# EasyEDA schematic Schematic_ESP8266_SensorBoard_With_Battery_protection.json
TITLE: Sheet_1; REV: 1.0; Date: 2022-03-02; Sheet: 1/1; Drawn By: drkoster; Company: Your Company
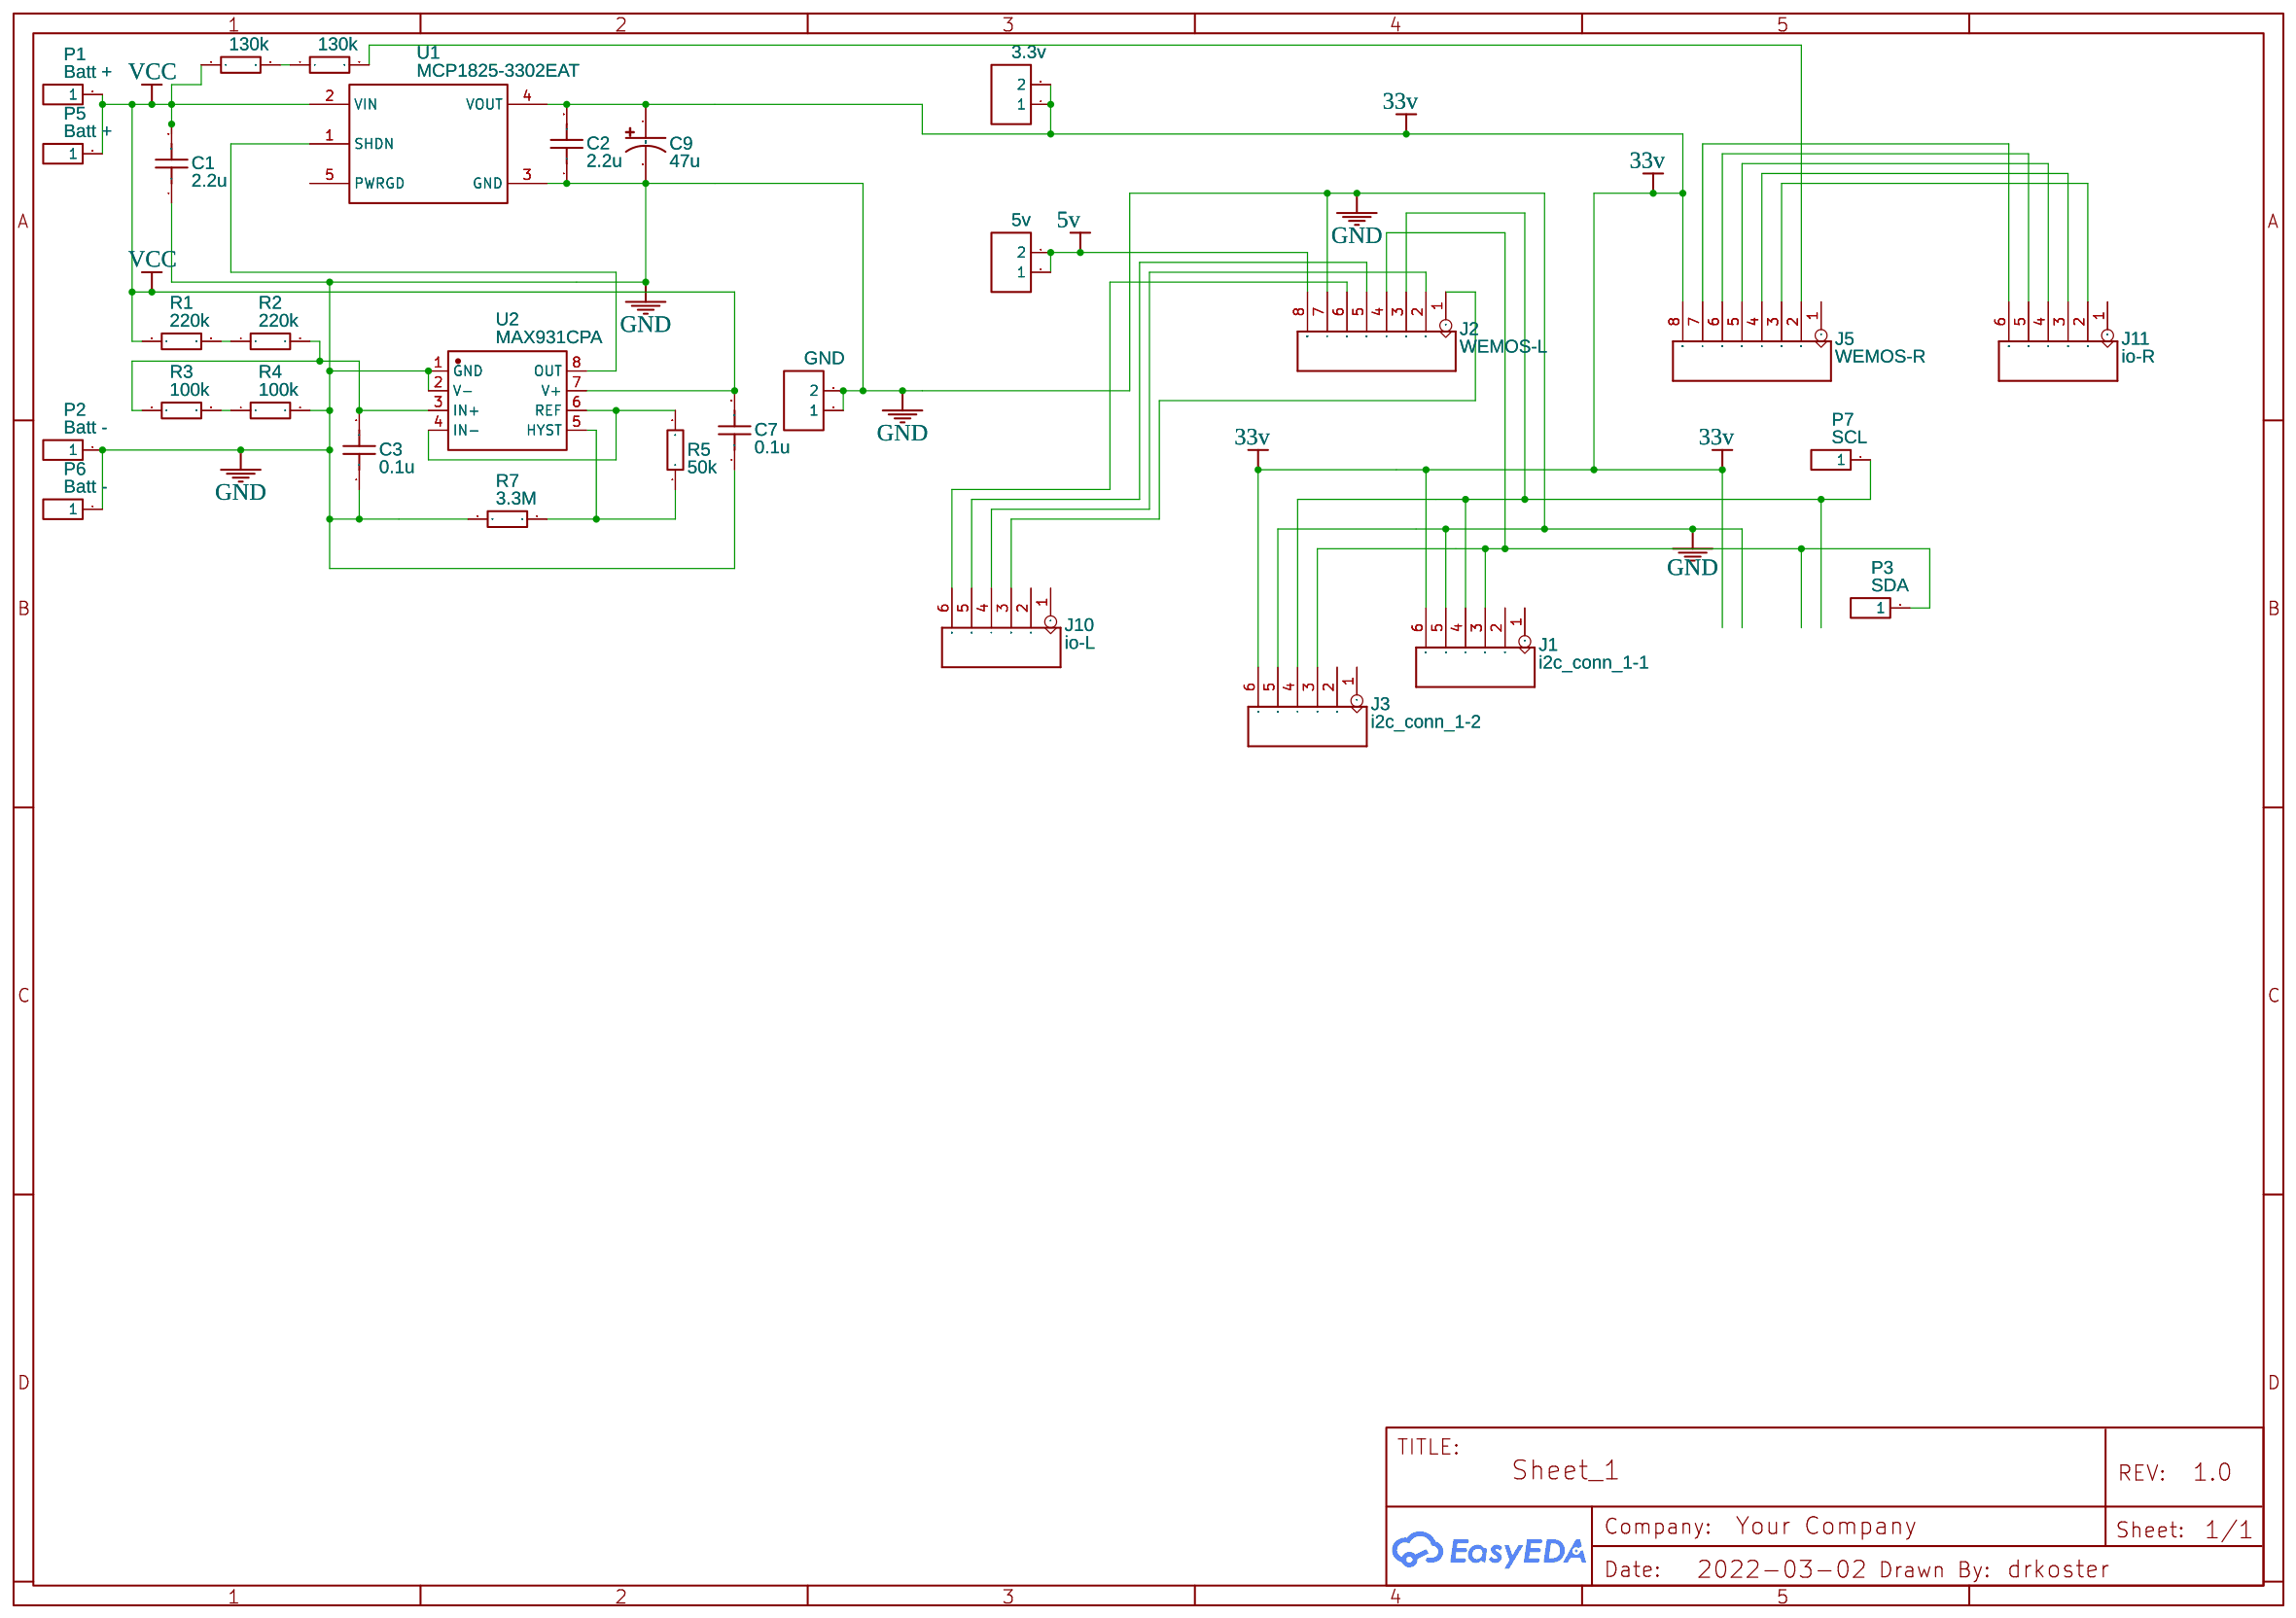
[diagram p0: schematic sheet]

## Parts
C1  2.2u  [RAD-0.1]
C2  2.2u  [RAD-0.1]
C3  0.1u  [RAD-0.1]
C7  0.1u  [RAD-0.1]
C9  47u  [CP_5X11MM]
H1  3.3v  [HDR-F-2.54_1X2]
H2  5v  [HDR-F-2.54_1X2]
H3  GND  [HDR-F-2.54_1X2]
J1  i2c_conn_1-1  [H6-2.54]
J2  WEMOS-L  [H8-2.54]
J3  i2c_conn_1-2  [H6-2.54]
J5  WEMOS-R  [H8-2.54]
J10  io-L  [H6-2.54]
J11  io-R  [H6-2.54]
P1  Batt +  [HDR-1X1/2.54]
P2  Batt -  [HDR-1X1/2.54]
P3  SDA  [HDR-1X1/2.54]
P5  Batt +  [HDR-1X1/2.54]
P6  Batt -  [HDR-1X1/2.54]
P7  SCL  [HDR-1X1/2.54]
R1  220k  [R_AXIAL-0.3]
R2  220k  [R_AXIAL-0.3]
R3  100k  [R_AXIAL-0.3]
R4  100k  [R_AXIAL-0.3]
R5  50k  [R_AXIAL-0.3]
R6  130k  [R_AXIAL-0.3]
R7  3.3M  [R_AXIAL-0.3]
R8  130k  [R_AXIAL-0.3]
U1  MCP1825-3302EAT  [TO-220-AT5]
U2  MAX931CPA  [MAX931CPA]

## Library data of the parts
C1-C3 C7 = Cap_RAD-0.1_US: Manufacturer Part: ?
C9 = Cap_Electrolytic(TH)_D3.0XF1.5_US: Manufacturer Part: ?
H1-H3 = HDR-F-2.54_1x2: Supplier Part: C49661; Supplier: LCSC; Contributor: LCEDA_Lib
J1 J3 J10 J11 = -: DIP Blue Female Header VERT; Manufacturer Part: F185-1106A1BSYA1
J2 J5 = -: DIP Long Black Female Header VERT;; Manufacturer Part: F185-1108A0BSYA5
P1-P3 P5-P7 = -: Supplier: LCSC; Manufacturer: ReliaPro; Manufacturer Part: Header-Male-2.54_1x1; Supplier Part: C81276
R1-R8 = MF1W-5.1Ω±1%: Supplier: LCSC; Manufacturer: CCO; Supplier Part: C127239
U1 = MCP1825-3302EAT: 500 mA, Low Voltage, Low Quiescent Current LDO Regulator, 5-Pin TO-220, Extended Temperature
U2 = MAX931CPA-DIP8: Manufacturer: MAXIM; Supplier: Mouser; Supplier Part: 700-MAX931CPA; link: https://www.onsemi.com/pub/Collateral/FOD814-D.PDF; Contributor: ASNMLT

## Nets
5v: H2.1 H2.2 J2.8
33v: C2.2 C9.1 H1.1 H1.2 J1.6 J3.6 J5.8 U1.4(VOUT)
GND: C1.1 C2.1 C3.1 C7.1 C9.2 H3.1 H3.2 J1.5 J2.7 J3.5 P2.1 P6.1 R4.2 R7.2 U1.3(GND) U2.1(GND) U2.2(V-)
VCC: C1.2 C7.2 P1.1 P5.1 R1.1 R6.1 U1.2(VIN) U2.7(V+)
Net-(C3-2): C3.2 R2.2 R3.1 U2.3(IN+)
Net-(J1-3): J1.3 J2.4 J3.3 P3.1
Net-(J1-4): J1.4 J2.3 J3.4 P7.1
Net-(J2-1): J2.1 J10.3
Net-(J2-2): J2.2 J10.4
Net-(J2-5): J2.5 J10.5
Net-(J2-6): J2.6 J10.6
Net-(J5-2): J5.2 R8.2
Net-(J5-3): J5.3 J11.2
Net-(J5-4): J5.4 J11.3
Net-(J5-5): J5.5 J11.4
Net-(J5-6): J5.6 J11.5
Net-(J5-7): J5.7 J11.6
Net-(R1-2): R1.2 R2.1
Net-(R3-2): R3.2 R4.1
Net-(R5-1): R5.1 R7.1 U2.5(HYST)
Net-(R5-2): R5.2 U2.4(IN-) U2.6(REF)
Net-(R6-2): R6.2 R8.1
Net-(U1-1): U1.1(SHDN) U2.8(OUT)

Not connected (* = marked no-connect by the designer): J1 1 2; J3 1 2; J5 1; J10 1 2; J11 1; U1 5(PWRGD)
